# Altium schematic sheet Buster_Controller.SchDoc: Buster Controller
size B; DrawnBy: Nikolina Bratic; SheetNumber: 4; SheetTotal: 4; Rule: PcbType=ProtelPcb
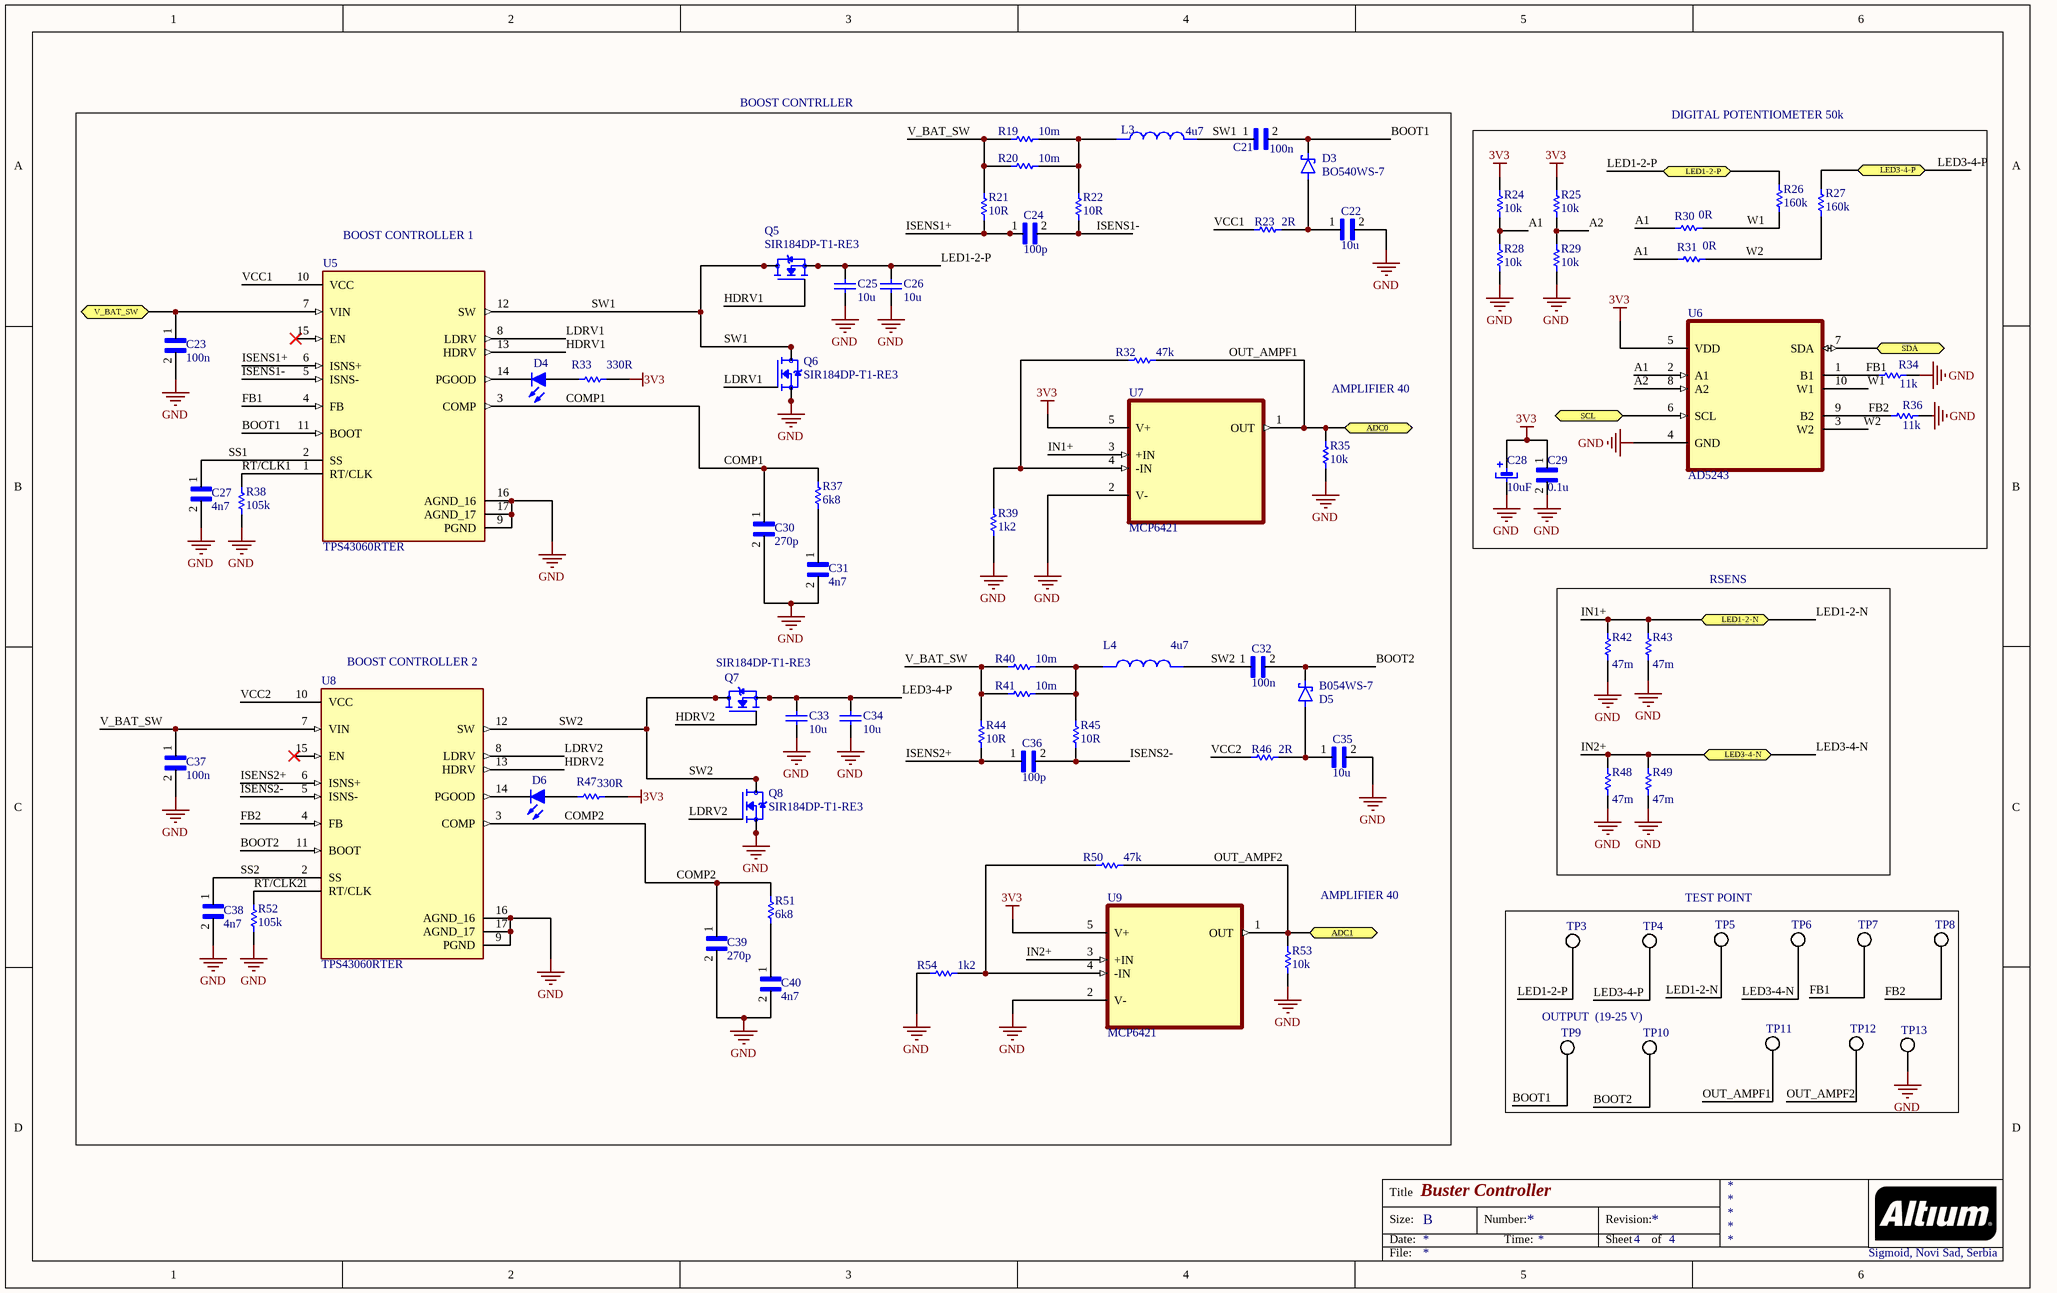
[diagram p0: Buster_Controller.SchDoc]

## Parts
C21  value 100n  [CAPC0402X22N]  (hidden comment: GRM0225C1E4R6CA03L_1)
C22  value 10u  [CAPC0402X22N]  (hidden comment: GRM0225C1E4R6CA03L_1)
C23  value 100n  [CAPC0402X22N]  (hidden comment: GRM0225C1E4R6CA03L_1)
C24  value 100p  [CAPC0402X22N]  (hidden comment: GRM0225C1E4R6CA03L_1)
C25  value 10u  [Capacitor SMD 1206]  (hidden comment: SMD Capacitor)
C26  value 10u  [Capacitor SMD 1206]  (hidden comment: SMD Capacitor)
C27  value 4n7  [CAPC0402X22N]  (hidden comment: GRM0225C1E4R6CA03L_1)
C28  value 10uF  [B Size Capacitor]  (hidden comment: SMD Tantalum Capacitor (B))
C29  value 0.1u  [CAPC0402X22N]  (hidden comment: GRM0225C1E4R6CA03L_1)
C30  value 270p  [CAPC0402X22N]  (hidden comment: GRM0225C1E4R6CA03L_1)
C31  value 4n7  [CAPC0402X22N]  (hidden comment: GRM0225C1E4R6CA03L_1)
C32  value 100n  [CAPC0402X22N]  (hidden comment: GRM0225C1E4R6CA03L_1)
C33  value 10u  [Capacitor SMD 1206]  (hidden comment: SMD Capacitor)
C34  value 10u  [Capacitor SMD 1206]  (hidden comment: SMD Capacitor)
C35  value 10u  [CAPC0402X22N]  (hidden comment: GRM0225C1E4R6CA03L_1)
C36  value 100p  [CAPC0402X22N]  (hidden comment: GRM0225C1E4R6CA03L_1)
C37  value 100n  [CAPC0402X22N]  (hidden comment: GRM0225C1E4R6CA03L_1)
C38  value 4n7  [CAPC0402X22N]  (hidden comment: GRM0225C1E4R6CA03L_1)
C39  value 270p  [CAPC0402X22N]  (hidden comment: GRM0225C1E4R6CA03L_1)
C40  value 4n7  [CAPC0402X22N]  (hidden comment: GRM0225C1E4R6CA03L_1)
D3  BO540WS-7  [SOD323]
D4  SMD LED  [SMD LED Diode]  (value not drawn)
D5  B054WS-7  [SOD323]
D6  SMD LED  [SMD LED Diode]  (value not drawn)
L3  value 4u7  [IND_XAL6060-472ME]  (hidden comment: XAL6060-472ME)
L4  value 4u7  [IND_XAL6060-472ME]  (hidden comment: XAL6060-472ME)
Q5  SIR184DP-T1-RE3  [TRANS_SIR184DP-T1-RE3]
Q6  SIR184DP-T1-RE3  [TRANS_SIR184DP-T1-RE3]
Q7  SIR184DP-T1-RE3  [TRANS_SIR184DP-T1-RE3]
Q8  SIR184DP-T1-RE3  [TRANS_SIR184DP-T1-RE3]
R19  value 10m  [Resistor SMD 1206]  (hidden comment: SMD Resistor)
R20  value 10m  [Resistor SMD 1206]  (hidden comment: SMD Resistor)
R21  value 10R  [RESC1005X35N]  (hidden comment: SMD Resistor)
R22  value 10R  [RESC1005X35N]  (hidden comment: SMD Resistor)
R23  value 2R  [RESC1005X35N]  (hidden comment: SMD Resistor)
R24  value 10k  [RESC1005X35N]  (hidden comment: SMD Resistor)
R25  value 10k  [RESC1005X35N]  (hidden comment: SMD Resistor)
R26  value 160k  [RESC1005X35N]  (hidden comment: SMD Resistor)
R27  value 160k  [RESC1005X35N]  (hidden comment: SMD Resistor)
R28  value 10k  [RESC1005X35N]  (hidden comment: SMD Resistor)
R29  value 10k  [RESC1005X35N]  (hidden comment: SMD Resistor)
R30  value 0R  [RESC1005X35N]  (hidden comment: SMD Resistor)
R31  value 0R  [RESC1005X35N]  (hidden comment: SMD Resistor)
R32  value 47k  [RESC1005X35N]  (hidden comment: SMD Resistor)
R33  value 330R  [RESC1005X35N]  (hidden comment: SMD Resistor)
R34  value 11k  [RESC1005X35N]  (hidden comment: SMD Resistor)
R35  value 10k  [RESC1005X35N]  (hidden comment: SMD Resistor)
R36  value 11k  [RESC1005X35N]  (hidden comment: SMD Resistor)
R37  value 6k8  [RESC1005X35N]  (hidden comment: SMD Resistor)
R38  value 105k  [RESC1005X35N]  (hidden comment: SMD Resistor)
R39  value 1k2  [RESC1005X35N]  (hidden comment: SMD Resistor)
R40  value 10m  [Resistor SMD 1206]  (hidden comment: SMD Resistor)
R41  value 10m  [Resistor SMD 1206]  (hidden comment: SMD Resistor)
R42  value 47m  [Resistor SMD 0603]  (hidden comment: SMD Resistor)
R43  value 47m  [Resistor SMD 0603]  (hidden comment: SMD Resistor)
R44  value 10R  [RESC1005X35N]  (hidden comment: SMD Resistor)
R45  value 10R  [RESC1005X35N]  (hidden comment: SMD Resistor)
R46  value 2R  [RESC1005X35N]  (hidden comment: SMD Resistor)
R47  value 330R  [RESC1005X35N]  (hidden comment: SMD Resistor)
R48  value 47m  [Resistor SMD 0603]  (hidden comment: SMD Resistor)
R49  value 47m  [Resistor SMD 0603]  (hidden comment: SMD Resistor)
R50  value 47k  [RESC1005X35N]  (hidden comment: SMD Resistor)
R51  value 6k8  [RESC1005X35N]  (hidden comment: SMD Resistor)
R52  value 105k  [RESC1005X35N]  (hidden comment: SMD Resistor)
R53  value 10k  [RESC1005X35N]  (hidden comment: SMD Resistor)
R54  value 1k2  [RESC1005X35N]  (hidden comment: SMD Resistor)
TP3  Test Point  [TEST POINT]  (value not drawn)
TP4  Test Point  [TEST POINT]  (value not drawn)
TP5  Test Point  [TEST POINT]  (value not drawn)
TP6  Test Point  [TEST POINT]  (value not drawn)
TP7  Test Point  [TEST POINT]  (value not drawn)
TP8  Test Point  [TEST POINT]  (value not drawn)
TP9  Test Point  [TEST POINT]  (value not drawn)
TP10  Test Point  [TEST POINT]  (value not drawn)
TP11  Test Point  [TEST POINT]  (value not drawn)
TP12  Test Point  [TEST POINT]  (value not drawn)
TP13  Test Point  [TEST POINT]  (value not drawn)
U5  TPS43060RTER  [QFN50P300X300X80-17N]
U6  AD5243  [SOP50P490X110-10N]
U7  MCP6421  [SOT65P210X110-5N]
U8  TPS43060RTER  [QFN50P300X300X80-17N]
U9  MCP6421  [SOT65P210X110-5N]

## Blocks framed on the sheet
DIGITAL POTENTIOMETER 50k: C28 C29 R24-R31 R34 R36 U6
RSENS: R42 R43 R48 R49

## Ports
ADC0, ADC1, LED1-2-N, LED1-2-P, LED3-4-N, LED3-4-P, SCL, SDA, V_BAT_SW

## Nets
3V3: C28.1 C29.1 R24.1 R25.1 R33.2 R47.2 U6.5(VDD) U7.5(V+) U9.5(V+)
GND: C22.2 C23.2 C25.1 C26.1 C27.2 C28.2 C29.2 C30.2 C31.2 C33.1 C34.1 C35.2 C37.2 C38.2 C39.2 C40.2 Q6.1(S) Q6.2(S) Q6.3(S) Q8.1(S) Q8.2(S) Q8.3(S) R28.2 R29.2 R34.1 R35.2 R36.1 R38.2 R39.1 R42.1 R43.1 R48.1 R49.1 R52.2 R53.2 R54.1 TP13.1 U5.9(PGND) U5.16(AGND_16) U5.17(AGND_17) U6.4(GND) U7.2(V-) U8.9(PGND) U8.16(AGND_16) U8.17(AGND_17) U9.2(V-)
A1: R24.2 R28.1 R30.1 R31.1 U6.2(A1)
A2: R25.2 R29.1 U6.8(A2)
BOOT1: C21.2 D3.C(K) TP9.1 U5.11(BOOT)
BOOT2: C32.2 D5.C(K) TP10.1 U8.11(BOOT)
COMP1: C30.1 R37.1 U5.3(COMP)
COMP2: C39.1 R51.1 U8.3(COMP)
FB1: R34.2 TP7.1 U5.4(FB) U6.1(B1)
FB2: R36.2 TP8.1 U6.9(B2) U8.4(FB)
HDRV1: Q5.4(G) U5.13(HDRV)
HDRV2: Q7.4(G) U8.13(HDRV)
IN1+: R42.2 R43.2 TP5.1 U7.3(+IN) ; port LED1-2-N  [also labelled LED1-2-N]
IN2+: R48.2 R49.2 TP6.1 U9.3(+IN) ; port LED3-4-N  [also labelled LED3-4-N]
ISENS1+: C24.1 R21.1 U5.6(ISNS+)
ISENS1-: C24.2 R22.1 U5.5(ISNS-)
ISENS2+: C36.1 R44.1 U8.6(ISNS+)
ISENS2-: C36.2 R45.1 U8.5(ISNS-)
LDRV1: Q6.4(G) U5.8(LDRV)
LDRV2: Q8.4(G) U8.8(LDRV)
LED1-2-P: C25.2 C26.2 Q5.1(S) Q5.2(S) Q5.3(S) R26.1 TP3.1 ; port LED1-2-P
LED3-4-P: C33.2 C34.2 Q7.1(S) Q7.2(S) Q7.3(S) R27.1 TP4.1 ; port LED3-4-P
OUT_AMPF1: R32.2 R35.1 TP11.1 U7.1(OUT) ; port ADC0
OUT_AMPF2: R50.2 R53.1 TP12.1 U9.1(OUT) ; port ADC1
RT/CLK1: R38.1 U5.1(RT/CLK)
RT/CLK2: R52.1 U8.1(RT/CLK)
SCL: U6.6(SCL) ; port SCL
SDA: U6.7(SDA) ; port SDA
SS1: C27.1 U5.2(SS)
SS2: C38.1 U8.2(SS)
SW1: Q5.5(D) Q5.6(D) Q5.7(D) Q5.8(D) Q5.9(D) Q6.5(D) Q6.6(D) Q6.7(D) Q6.8(D) Q6.9(D) U5.12(SW)
SW2: C32.1 L4.2 Q7.5(D) Q7.6(D) Q7.7(D) Q7.8(D) Q7.9(D) Q8.5(D) Q8.6(D) Q8.7(D) Q8.8(D) Q8.9(D) U8.12(SW)
V_BAT_SW: C37.1 R19.1 R20.1 R21.2 R40.1 R41.1 R44.2 U8.7(VIN)
V_BAT_SW: C23.1 U5.7(VIN) ; port V_BAT_SW  [a separate net that carries the same name]
VCC1: R23.2 U5.10(VCC)
VCC2: R46.2 U8.10(VCC)
W1: R26.2 R30.2 U6.10(W1)
W2: R27.2 R31.2 U6.3(W2)
NetC21_1: C21.1 L3.2
NetC22_1: C22.1 D3.A R23.1
NetC31_1: C31.1 R37.2
NetC35_1: C35.1 D5.A R46.1
NetC40_1: C40.1 R51.2
NetD4_1: D4.1(A) R33.1
NetD4_2: D4.2(K) U5.14(PGOOD)
NetD6_1: D6.1(A) R47.1
NetD6_2: D6.2(K) U8.14(PGOOD)
NetL3_1: L3.1 R19.2 R20.2 R22.2
NetL4_1: L4.1 R40.2 R41.2 R45.2
NetR32_1: R32.1 R39.2 U7.4(-IN)
NetR50_1: R50.1 R54.2 U9.4(-IN)

Not connected (* = marked no-connect by the designer): U5 15(EN)*; U8 15(EN)*

## Notes on the sheet
- BOOST CONTRLLER
- (near U5) BOOST CONTROLLER 1
- (near R35) AMPLIFIER 40
- (near U8) BOOST CONTROLLER 2
- AMPLIFIER 40
- TEST POINT
- OUTPUT  (19-25 V)
- Sigmoid, Novi Sad, Serbia
- Labels drawn without touching a wire or pin: SW1
- Title
- Size:
- Date:
- B
- Number:
- Time:
- Revision:
- Sheet
- of
- File:

## Library data of the parts
C21-C24 C27 C29-C32 C35-C40 = GRM0225C1E4R6CA03L_1: SMD Capacitor C0G(EIA) with Capacitance: 4.6pF Tol. 0.25pF. Rated Voltage: 25Vdc; Package: None; Price: None; MP: GRM0225C1E4R6CA03L; Availability: Unavailable
C28 = SMD Tantalum Capacitor (B)_1: Package: SMD 3528 (B)
D3 = MBRS340: Diode, Signal, Schottky  (SOD-323); MF: ON Semiconductor; SnapEDA_Link: https://www.snapeda.com/parts/MBRS340/ON%20Semiconductor/view-part/1473135/?ref=snap; Value: *; MP: MBRS340; Availability: Unavailable; Package: DO-214 ON Semiconductor; DigiKey-Purchase-URL: https://snapeda.com/shop?store=DigiKey&id=1473135; Price: None
D4 D6 = SMD LED Diode: SMD LED (Red, Low Current Type)
D5 = MBRS340: Diode, Signa, Schottky (SOD-323); MF: ON Semiconductor; SnapEDA_Link: https://www.snapeda.com/parts/MBRS340/ON%20Semiconductor/view-part/1473135/?ref=snap; Value: *; MP: MBRS340; Availability: Unavailable; Package: DO-214 ON Semiconductor; DigiKey-Purchase-URL: https://snapeda.com/shop?store=DigiKey&id=1473135; Price: None
L3 L4 = XAL6060-472ME: Power inductor, shielded, 20% tol, SMT, RoHS, halogen f; Package: None; Price: None; MP: XAL6060-472ME; Availability: Unavailable
U5 U8 = TPS43060RTER: Low Iq, 58V, Synchronous Boost Controller w/ Wide Input Voltage & 7.5V Gate Drive for Standard FETs 16-WQFN -40 to 150; MF: Texas Instruments; SnapEDA_Link: https://www.snapeda.com/parts/TPS43060RTER/Texas%20Instruments/view-part/524817/?ref=snap; MP: TPS43060RTER; Availability: Good; Price: None; Value: *; Purchase-URL: https://pricing.snapeda.com/search/part/TPS43060RTER/?ref=eda; Package: WQFN-16 Texas Instruments
U6 = AD5243BRMZ50-RL7: Digital Digital Potentiometer 50k Ohm 2 Circuit 256 Taps I²C Interface 10-MSOP; MP: AD5248BRMZ50-RL7; MF: Analog Devices; Availability: Unavailable; Price: None; Value: *; SnapEDA_Link: https://www.snapeda.com/parts/AD5248BRMZ50-RL7/Analog%20Devices%20Inc./view-part/435262/?ref=snap; Package: MSOP-10 Analog Devices
U7 U9 = MCP6421: General Purpose Amplifier 1 Circuit Rail-to-Rail SC70-5; MF: Analog Devices; MP: LTC2050HVCS5#TRMPBF; Package: SOT-23-5 Analog Devices; Value: *; Price: None; Availability: Warning; Mouser-Purchase-URL: https://snapeda.com/shop?store=Mouser&id=4346571; SnapEDA_Link: https://www.snapeda.com/parts/LTC2050HVCS5%23TRMPBF/Analog%20Devices/view-part/4346571/?ref=snap
Q5-Q8 = SIR184DP-T1-RE3: Package: None; Price: None; Value: *; MP: SIR184DP-T1-RE3; Availability: Unavailable